# EAGLE design LNA-fantom (EAGLE 7.2.0)
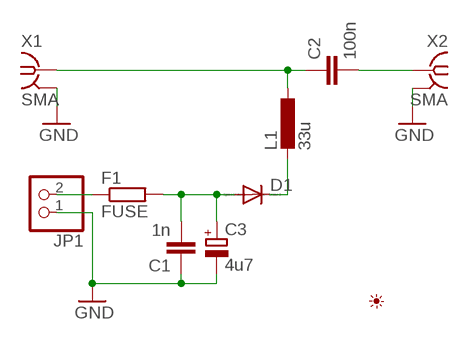
[diagram p0: schematic, sheet 1]

## Parts
C1  1n  C-EUC0805  [C0805]
C2  100n  C-EUC0805  [C0805]
C3  4u7  CPOL-EUSMCA  [SMC_A]
D1  DIODE-MINIMELF  [MINIMELF]
F1  FUSE  R-EU_R1210  [R1210]
JP1  PINHD-1X2  [1X02]
L1  33u  L-EUWE-TPC  [POWER-CHOKE_WE-TPC]
U$1  PICTO_1  [PICTO_1]
X1  SMA  SMA-142-0701-801/806  [J502-ND-142-0701-801/806]
X2  SMA  SMA-142-0701-801/806  [J502-ND-142-0701-801/806]

## Nets
GND: C1.1 C3.- JP1.1 X1.G@1 X1.G@2 X1.G@3 X1.G@4 X2.G@1 X2.G@2 X2.G@3 X2.G@4
N$1: F1.1 JP1.2
N$2: C1.2 C3.+ D1.A F1.2
N$4 [RF]: C2.1 L1.1 X1.1
N$5 [RF]: C2.2 X2.1
N$6: D1.C L1.2

## Library data of the parts
C1 C2 = rcl:C-EU: CAPACITOR, European symbol
C3 = rcl:CPOL-EU: POLARIZED CAPACITOR, European symbol
D1 = diode:DIODE-: DIODE
F1 = rcl:R-EU_: RESISTOR, European symbol
JP1 = pinhead:PINHD-1X2: PIN HEADER
L1 = rcl:L-EU: INDUCTOR, European symbol
U$1 = My_Picto:PICTO_1: Zdenek Brichacek; OK3ZB; http://blog.brichacek.net
X1 X2 = con-coax:SMA-: SMA 50 Ohm End Launch Jack Receptacle - Round Contact Johnson Components Source: www.johnsoncomponents.com .. J502-ND.pdf; MF: JOHNSON COMPONENTS; MPN: 142-0701-801; OC_FARNELL: 1608592; OC_NEWARK: 90F2624

## Net classes
1 RF: width 2.5 mm, clearance 0.508 mm
2 N$2: width 1 mm

## Board
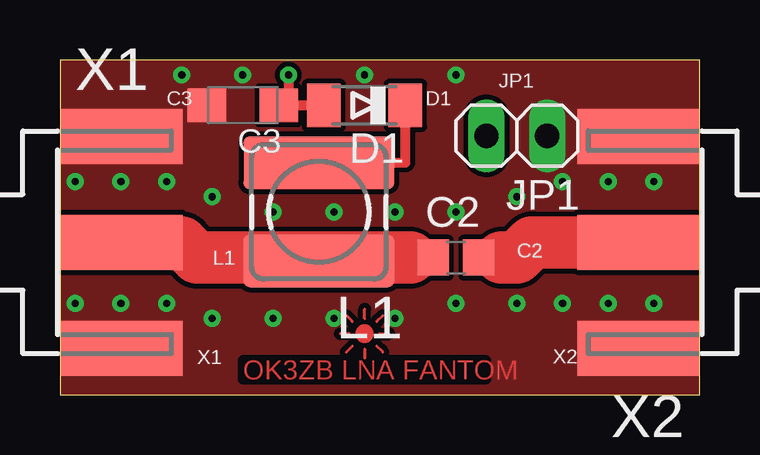
[diagram p1: board, top side]
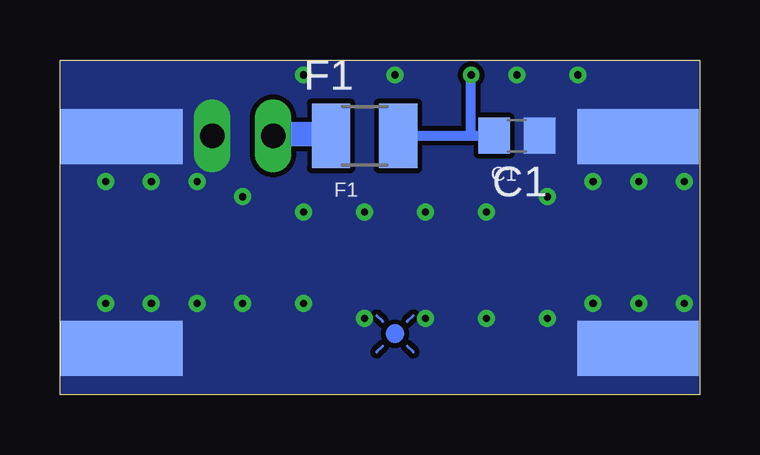
[diagram p2: board, bottom side, seen from below]

Size 26.67 x 13.96 mm. Coordinates in mm from the lower left corner, seen from the top.
Outline: 0,0 26.67,0 26.67,13.96 0,13.96 0,0
Copper layers (1*16): Top 0.035mm / dielectric 1.5mm / Bottom 0.035mm
Design rules "default *": minimum track width 10mil, minimum drill 24mil, track to track 8mil, track to pad 8mil, pad to pad 8mil, via to via 8mil, smd to smd 8mil, copper to edge 0mil, drill to drill 8mil, minimum pad ring 10mil, minimum via ring 8mil, stop-mask expansion 4mil, vias tented up to drill 0mil, thermal gap 0mil

### Footprints (pad centres in the part's own frame; a part is rotated, then mirrored left to right if it is on the bottom)
C0805 = smd 1.3 x 1.5: 1 -0.95,0; 2 0.95,0
SMC_A = smd 1.6 x 1.4: + -1.5,0; - 1.5,0
MINIMELF = smd 1.4 x 1.8: A 1.7,0; C -1.7,0
R1210 = smd 1.6 x 2.7: 1 -1.4,0; 2 1.4,0
1X02 = drill 1.016 long: 1 -1.27,0; 2 1.27,0
POWER-CHOKE_WE-TPC = smd 6.3 x 2.2: 1 0,2.05; 2 0,-2.05
J502-ND-142-0701-801/806 = smd 5.08 x 2.286: 1 2.565,0; G@1 2.565,4.42; G@2 2.565,-4.42 | smd 5.08 x 2.286 bottom: G@3 2.565,4.42; G@4 2.565,-4.42

### Placement (x,y rotation side)
C1  7.62,10.79 180 bottom
C2  16.51,5.71 0 top
C3  7.62,12.06 180 top
D1  12.7,12.06 180 top
F1  13.97,10.79 0 bottom
JP1  19.05,10.79 180 top
L1  10.79,7.62 180 top
U$1  12.7,2.54 0 top
X1  0,6.35 0 top
X2  26.67,6.35 180 top

### Tracks (layer width: path | path; a pad name or v marks a point on that pad's centre or on a via)
GND  (via drill 0.3)
  other vias: 0.64,8.89 2.54,8.89 4.45,8.89 0.64,3.81 2.54,3.81 4.45,3.81 8.89,3.17 11.43,3.17 13.97,3.17 16.51,3.81 19.05,3.81 20.95,3.81 22.86,3.81 24.77,3.81 6.35,8.26 16.51,7.62 20.95,8.89 22.86,8.89 24.77,8.89 19.05,8.26 6.35,3.17 7.62,13.34 12.7,13.34 5.08,13.34 16.51,13.34 11.43,7.62 8.89,7.62 13.97,7.62
  pour Top: 0,13.97 26.67,13.97 26.67,0 0,0
  pour Bottom: 0,13.97 26.67,13.97 26.67,0 0,0
N$1
  Bottom 0.254: 15.42,10.86 F1.1
  Bottom 1.016: 15.42,10.86 17.78,10.86 JP1.2
N$2  (via drill 0.3)
  Top 0.254: 9.53,12.06 C3.+
  Top 0.406: v9.53,13.34 9.53,12.06 | C3.+ D1.A
  Bottom 0.254: C1.2 9.53,10.79
  Bottom 0.406: 9.53,10.79 v9.53,13.34 | F1.2 C1.2
N$4
  Top 0.813: 14.61,5.71 C2.1
  Top 2.184: L1.1 8.29,5.71 | 8.29,5.71 14.61,5.71 | X1.1 5.08,6.35 5.71,5.71 8.29,5.71
N$5
  Top 0.813: C2.2 17.78,5.71
  Top 1.016: 17.78,5.71 18.41,5.71
  Top 2.184: X2.1 19.68,6.35 19.05,5.71 18.41,5.71
N$6
  Top 0.406: L1.2 14.4,9.67 D1.C

### Text on the board
Top: OK3ZB LNA FANTOM
_tNames: JP1 | C3 | D1 | L1 | C2 | X2 | X1
_bNames: C1 | F1